# Altium schematic sheet 1_P1.schdoc
size 307 x 218 mm; Symbol: Drawing-Symbol_A4; Device: Drawing-Symbol_A4; @Project Name: telescope; @Page Count: 1; @Update Date: 2026-06-26; @Create Date: 2026-06-26; @Schematic Name: Schematic1; @Page No: 1; @Page Name: P1; Company: EasyEDA.com; Version: V1.0; Page Size: A4; @Create Time: 15:22:58; @Update Time: 16:22:58; Width: 1170; Height: 825; Region Start: 1; X Region Count: 6; Y Region Count: 4; Blade Width: 10; Title Block Position: 3; @Board Name: Board1
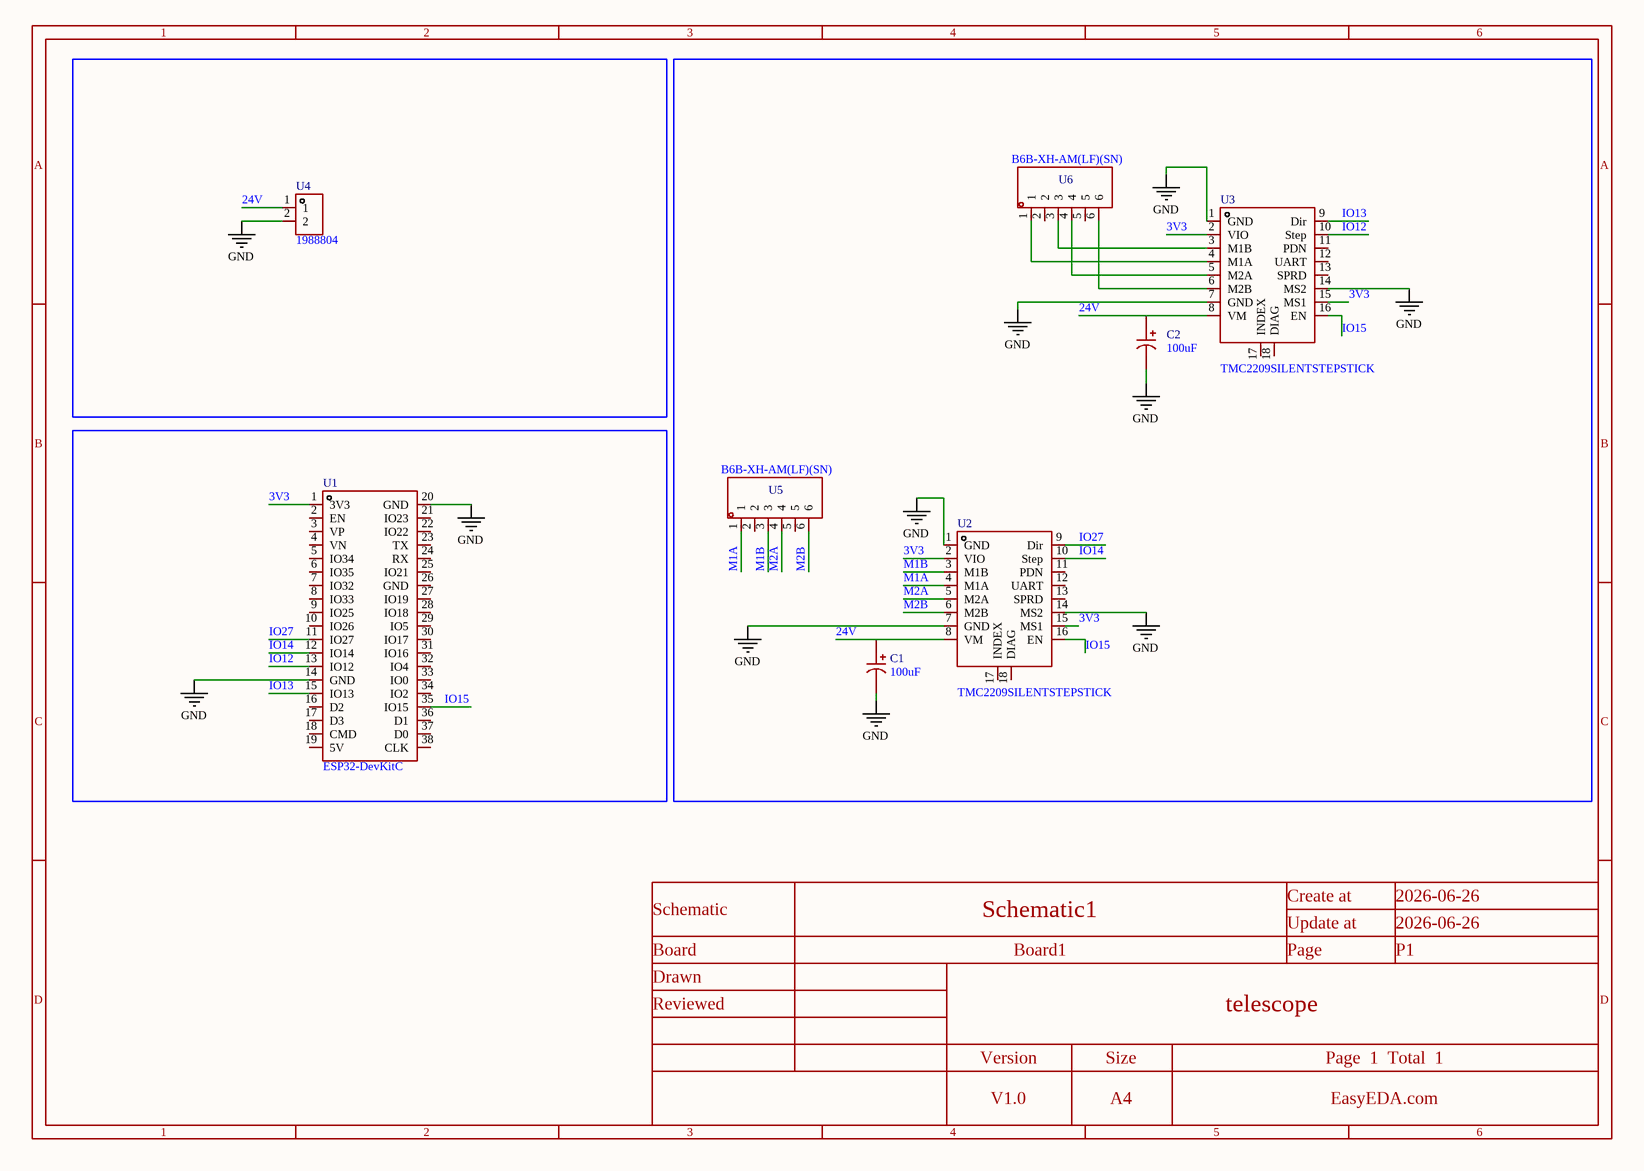
[diagram p0: 1_P1.schdoc]

## Parts
C1  100uF  [CAP-TH_BD8.0-P3.50-D0.6-FD-H10.0]
C2  100uF  [CAP-TH_BD8.0-P3.50-D0.6-FD-H10.0]
U1  ESP32-DevKitC  [BULETM-SMD_ESP32-DEVKITC]
U2  TMC2209SILENTSTEPSTICK  [COMM-TH_TMC2209SILENTSTEPSTICK]
U3  TMC2209SILENTSTEPSTICK  [COMM-TH_TMC2209SILENTSTEPSTICK]
U4  1988804  [CONN-TH_1988804]
U5  B6B-XH-AM(LF)(SN)  [CONN-TH_6P-P2.50_B6B-XH-AM-LF-SN]
U6  B6B-XH-AM(LF)(SN)  [CONN-TH_6P-P2.50_B6B-XH-AM-LF-SN]

## Nets
GND: C1.2 C2.2 U1.14(GND) U1.20(GND) U2.1(GND) U2.7(GND) U2.14(MS2) U3.1(GND) U3.7(GND) U3.14(MS2) U4.2
3V3: U1.1(3V3) U2.2(VIO) U2.15(MS1) U3.2(VIO) U3.15(MS1)
24V: C1.1 C2.1 U2.8(VM) U3.8(VM) U4.1
IO12: U1.13(IO12) U3.10(Step)
IO13: U1.15(IO13) U3.9(Dir)
IO14: U1.12(IO14) U2.10(Step)
IO15: U1.35(IO15) U2.16(EN) U3.16(EN)
IO27: U1.11(IO27) U2.9(Dir)
M1A: U2.4(M1A) U5.1
M1B: U2.3(M1B) U5.3
M2A: U2.5(M2A) U5.4
M2B: U2.6(M2B) U5.6
NetU3_3: U3.3(M1B) U6.3
NetU3_4: U3.4(M1A) U6.1
NetU3_5: U3.5(M2A) U6.4
NetU3_6: U3.6(M2B) U6.6

Not connected (* = marked no-connect by the designer): U1 2(EN) 3(VP) 4(VN) 5(IO34) 6(IO35) 7(IO32) 8(IO33) 9(IO25) 10(IO26) 16(D2) 17(D3) 18(CMD) 19(5V) 21(IO23) 22(IO22) 23(TX) 24(RX) 25(IO21) 26(GND) 27(IO19) 28(IO18) 29(IO5) 30(IO17) 31(IO16) 32(IO4) 33(IO0) 34(IO2) 36(D1) 37(D0) 38(CLK); U2 11(PDN) 12(UART) 13(SPRD) 17(INDEX) 18(DIAG); U3 11(PDN) 12(UART) 13(SPRD) 17(INDEX) 18(DIAG); U5 2 5; U6 2 5

## Notes on the sheet
- 1
- 2
- 3
- 4
- 5
- 6
- A
- B
- C
- Schematic
- Schematic1
- Create at
- Update at
- 2026-06-26
- Board
- Drawn
- Board1
- Page
- P1
- D
- Reviewed
- Version
- Size
- telescope
- Page  1  Total  1
- V1.0
- A4
- EasyEDA.com

## Library data of the parts
C1 C2 = 100uF35V8x11GF: Manufacturer: Econd(米朗电子); Add into BOM: yes; Tolerance: ±20%; Voltage Rating: 35V; Ripple Current: 640mA@100KHz; Equivalent Series Resistance(ESR): 170mΩ; Pin Spacing: 3.5mm; Lifetime: 3000hrs@105℃; Symbol: 100UF35V8X11GF; Device: 100uF35V8x11GF; LCSC Part Name: 100uF ±20% 35V; Supplier Part: C49304899; Manufacturer Part: 100uF35V8x11GF; Supplier Footprint: 插件,D8xL11mm; JLCPCB Part Class: Extended Part; Datasheet: https://item.szlcsc.com/datasheet/100uF35V8x11GF/51766727.html; Supplier: LCSC; Convert to PCB: yes; Value: 100uF; Diameter: 8mm; Height - Seated (Max): 11mm; Operating Temperature: -40℃~+105℃
U1 = ESP32-DevKitC: Manufacturer: ESPRESSIF(乐鑫); Add into BOM: yes; Symbol: ESP32-DEVKITC; Device: ESP32-DevKitC; LCSC Part Name: 开发板; Supplier Part: C571180; Manufacturer Part: ESP32-DevKitC; Supplier Footprint: -; JLCPCB Part Class: Extended Part; Datasheet: https://atta.szlcsc.com/upload/public/pdf/source/20200521/C529586_D6FCDAFCFF160B3EDDF7DF28D600699D.pdf; Supplier: LCSC; Convert to PCB: yes; CPU: -; ROM Size: -; USB: -; WIFI Protocols: -; Bluetooth: -; Ethernet: -; Audio & Video Interface: -; Multimedia Support: -; Card Type: -; Power Supply Type: -; Power Supply: -; POE Support: -; Resolution: -; Temperature Range: -
U2 U3 = TMC2209SILENTSTEPSTICK: Manufacturer: TRINAMIC; Add into BOM: yes; Symbol: TMC2209SILENTSTEPSTICK; Device: TMC2209SILENTSTEPSTICK; LCSC Part Name: TMC2209SILENTSTEPSTICK; Supplier Part: C17375345; Manufacturer Part: TMC2209SILENTSTEPSTICK; Supplier Footprint: -; JLCPCB Part Class: Extended Part; Datasheet: https://item.szlcsc.com/datasheet/TMC2209SILENTSTEPSTICK/18504516.html; Supplier: LCSC; Convert to PCB: yes; Type: Power Management
U4 = 1988804: Manufacturer: Phoenix Contact(菲尼克斯); Add into BOM: yes; Pitch: 5mm; Number of PINs Per Row: 2; Current Rating: 15A; Voltage Rating (Max): 300V; Symbol: 1988804; Device: 1988804; LCSC Part Name: 5mm 排数:1 每排P数:2 直插; Supplier Part: C7168402; Manufacturer Part: 1988804; Supplier Footprint: 插件,P=5mm; JLCPCB Part Class: Extended Part; Datasheet: https://item.szlcsc.com/datasheet/1988804/8135357.html; Supplier: LCSC; Convert to PCB: yes; Color: Green; Mounting Type: Through Hole; Number of Pins: 2P; Number of Rows: 1
U5 U6 = B6B-XH-AM(LF)(SN): Manufacturer: JST; Symbol: B6B-XH-AM-(LF)(SN); Add into BOM: yes; Pins Structure: 1x6P; Pitch: 2.5mm; Reference Series: XH; Number of PINs Per Row: 6; Current Rating: 3A; Voltage Rating: 250V; Plastic Material: PA66; Flame Retardant Rating: UL94V-0; Supplementary Features: Pillar；K Pin; Z-Height of the Board: 7mm; X-Length of Bottom Edge on Board (Spacing Line): 17.4mm; Y-Width of Bottom Edge on Board: 5.75mm; Device: B6B-XH-AM(LF)(SN); LCSC Part Name: 1x6P 间距:2.5mm 直插 系列:XH; Supplier Part: C161873; Manufacturer Part: B6B-XH-AM(LF)(SN); Supplier Footprint: 插件,P=2.5mm; JLCPCB Part Class: Extended Part; Datasheet: https://item.szlcsc.com/datasheet/B6B-XH-AM(LF)(SN)/173254.html; Supplier: LCSC; Convert to PCB: yes; Mounting Type: Through Hole; Number of Pins: 6P; Number of Rows: 1; Row Spacing: -; Contact Material: Brass; Contact Plating: Tin; Operating Temperature: -25℃~+85℃; Color: White